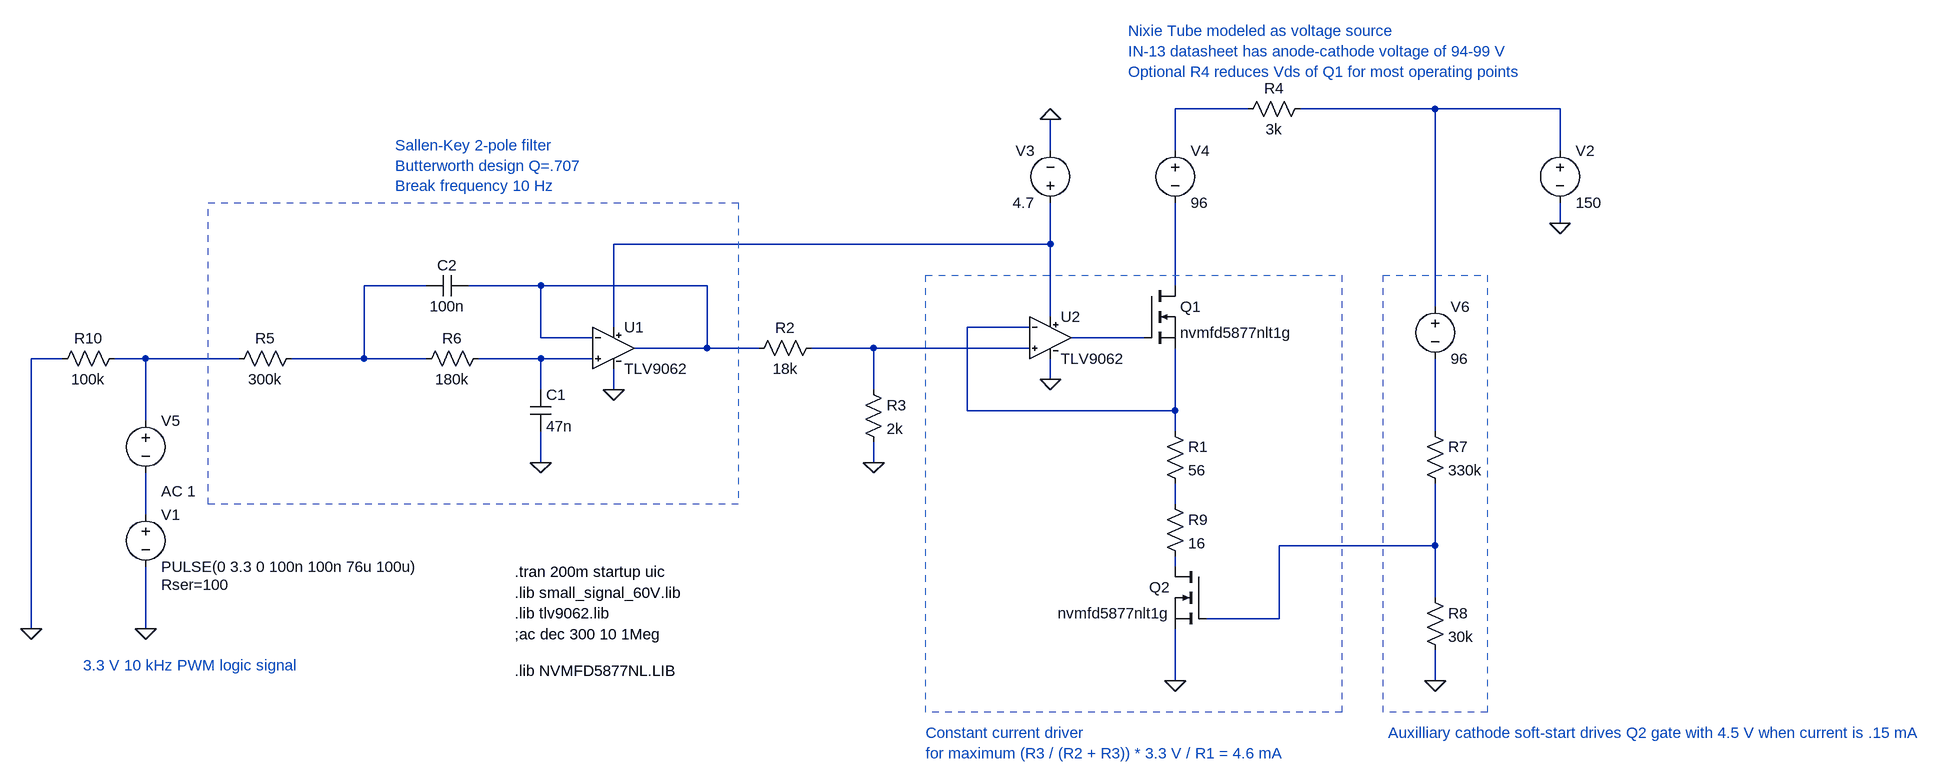
[diagram p0: schematic Nixie driver.asc]
Nixie driver.asc, the LTspice schematic file:
Version 4
SHEET 1 1912 868
WIRE 832 -144 720 -144
WIRE 1120 -144 912 -144
WIRE 1312 -144 1120 -144
WIRE 528 -80 528 -128
WIRE 720 -80 720 -144
WIRE 1312 -80 1312 -144
WIRE 1312 32 1312 0
WIRE 528 64 528 0
WIRE 528 64 -144 64
WIRE -432 128 -528 128
WIRE -256 128 -368 128
WIRE 0 128 -256 128
WIRE 720 128 720 0
WIRE 1120 160 1120 -144
WIRE 528 176 528 64
WIRE -144 192 -144 64
WIRE 496 192 400 192
WIRE -256 208 -256 128
WIRE -176 208 -256 208
WIRE 672 208 560 208
WIRE 0 224 0 128
WIRE 0 224 -112 224
WIRE 80 224 0 224
WIRE 256 224 160 224
WIRE 496 224 256 224
WIRE -992 240 -1040 240
WIRE -864 240 -912 240
WIRE -720 240 -864 240
WIRE -528 240 -528 128
WIRE -528 240 -640 240
WIRE -432 240 -528 240
WIRE -256 240 -352 240
WIRE -176 240 -256 240
WIRE 528 272 528 240
WIRE -256 288 -256 240
WIRE -144 288 -144 256
WIRE 256 288 256 224
WIRE 400 320 400 192
WIRE 720 320 720 224
WIRE 720 320 400 320
WIRE -864 336 -864 240
WIRE 720 352 720 320
WIRE 1120 352 1120 240
WIRE -256 400 -256 352
WIRE 256 400 256 368
WIRE 720 464 720 432
WIRE -864 480 -864 416
WIRE 1120 528 1120 432
WIRE 1120 528 880 528
WIRE 720 560 720 544
WIRE 1120 608 1120 528
WIRE 880 640 880 528
WIRE 880 640 768 640
WIRE -1040 656 -1040 240
WIRE -864 656 -864 560
WIRE 720 736 720 656
WIRE 1120 736 1120 688
FLAG -864 656 0
FLAG 528 272 0
FLAG 528 -128 0
FLAG 1312 32 0
FLAG 720 736 0
FLAG 256 400 0
FLAG -256 400 0
FLAG -144 288 0
FLAG 1120 736 0
FLAG -1040 656 0
SYMBOL voltage -864 464 R0
WINDOW 123 0 0 Left 0
WINDOW 39 24 124 Left 2
SYMATTR SpiceLine Rser=100
SYMATTR InstName V1
SYMATTR Value PULSE(0 3.3 0 100n 100n 76u 100u)
SYMBOL voltage 1312 -96 R0
WINDOW 123 0 0 Left 0
WINDOW 39 0 0 Left 0
SYMATTR InstName V2
SYMATTR Value 150
SYMBOL voltage 528 16 R180
WINDOW 0 24 96 Left 2
WINDOW 3 24 16 Left 2
WINDOW 123 0 0 Left 0
WINDOW 39 0 0 Left 0
SYMATTR InstName V3
SYMATTR Value 4.7
SYMBOL nmos 672 128 R0
SYMATTR InstName Q1
SYMATTR Value nvmfd5877nlt1g
SYMATTR Prefix X
SYMBOL voltage 720 -96 R0
WINDOW 123 0 0 Left 0
WINDOW 39 0 0 Left 0
SYMATTR InstName V4
SYMATTR Value 96
SYMBOL res 704 336 R0
SYMATTR InstName R1
SYMATTR Value 56
SYMBOL res 64 240 R270
WINDOW 0 32 56 VTop 2
WINDOW 3 0 56 VBottom 2
SYMATTR InstName R2
SYMATTR Value 18k
SYMBOL res 240 272 R0
SYMATTR InstName R3
SYMATTR Value 2k
SYMBOL res 928 -160 R90
WINDOW 0 0 56 VBottom 2
WINDOW 3 32 56 VTop 2
SYMATTR InstName R4
SYMATTR Value 3k
SYMBOL res -624 224 R90
WINDOW 0 0 56 VBottom 2
WINDOW 3 32 56 VTop 2
SYMATTR InstName R5
SYMATTR Value 300k
SYMBOL cap -272 288 R0
SYMATTR InstName C1
SYMATTR Value 47n
SYMBOL res -336 224 R90
WINDOW 0 0 56 VBottom 2
WINDOW 3 32 56 VTop 2
SYMATTR InstName R6
SYMATTR Value 180k
SYMBOL cap -368 112 R90
WINDOW 0 0 32 VBottom 2
WINDOW 3 32 32 VTop 2
SYMATTR InstName C2
SYMATTR Value 100n
SYMBOL voltage -864 320 R0
WINDOW 123 24 124 Left 2
WINDOW 39 0 0 Left 0
SYMATTR Value2 AC 1
SYMATTR InstName V5
SYMATTR Value ""
SYMBOL voltage 1120 144 R0
WINDOW 123 0 0 Left 0
WINDOW 39 0 0 Left 0
SYMATTR InstName V6
SYMATTR Value 96
SYMBOL res 1104 336 R0
SYMATTR InstName R7
SYMATTR Value 330k
SYMBOL res 1104 592 R0
SYMATTR InstName R8
SYMATTR Value 30k
SYMBOL nmos 768 560 M0
SYMATTR InstName Q2
SYMATTR Value nvmfd5877nlt1g
SYMATTR Prefix X
SYMBOL TLV9062 -144 160 R0
SYMATTR InstName U1
SYMBOL TLV9062 528 144 R0
SYMATTR InstName U2
SYMBOL res 704 448 R0
SYMATTR InstName R9
SYMATTR Value 16
SYMBOL res -896 224 R90
WINDOW 0 0 56 VBottom 2
WINDOW 3 32 56 VTop 2
SYMATTR InstName R10
SYMATTR Value 100k
TEXT -296 568 Left 2 !.tran 200m startup uic
TEXT -296 600 Left 2 !.lib small_signal_60V.lib
TEXT -296 632 Left 2 !.lib tlv9062.lib
TEXT -296 664 Left 2 !;ac dec 300 10 1Meg
TEXT -480 -88 Left 2 ;Sallen-Key 2-pole filter\nButterworth design Q=.707\nBreak frequency 10 Hz
TEXT 648 -264 Left 2 ;Nixie Tube modeled as voltage source\nIN-13 datasheet has anode-cathode voltage of 94-99 V\nOptional R4 reduces Vds of Q1 for most operating points
TEXT 336 816 Left 2 ;Constant current driver\nfor maximum (R3 / (R2 + R3)) * 3.3 V / R1 = 4.6 mA
TEXT -960 712 Left 2 ;3.3 V 10 kHz PWM logic signal
TEXT 1048 816 Left 2 ;Auxilliary cathode soft-start drives Q2 gate with 4.5 V when current is .15 mA
TEXT -296 720 Left 2 !.lib NVMFD5877NL.LIB
RECTANGLE Normal 48 464 -768 0 1
RECTANGLE Normal 976 784 336 112 1
RECTANGLE Normal 1200 784 1040 112 1

The netlist it stands for:
* Nixie driver.asc
V1 N014 0 PULSE(0 3.3 0 100n 100n 76u 100u) Rser=100
V2 N002 0 150
V3 N003 0 4.7
XQ1 N006 N008 N007 nvmfd5877nlt1g  ; pins D G S
V4 N001 N006 96
R1 N007 N013 56
R2 N005 N009 18k
R3 N009 0 2k
R4 N002 N001 3k
R5 N004 N010 300k
C1 N011 0 47n
R6 N011 N004 180k
C2 N005 N004 100n
V5 N010 N014 AC 1
V6 N002 N012 96
R7 N012 N015 330k
R8 N015 0 30k
XQ2 N016 N015 0 nvmfd5877nlt1g  ; pins D G S
XU1 N011 N005 N003 0 N005 TLV9062  ; pins In+ In- V+ V- OUT
XU2 N009 N007 N003 0 N008 TLV9062  ; pins In+ In- V+ V- OUT
R9 N013 N016 16
R10 N010 0 100k
.tran 200m startup uic
.lib small_signal_60V.lib
.lib tlv9062.lib
;ac dec 300 10 1Meg
* Sallen-Key 2-pole filter
* Butterworth design Q=.707
* Break frequency 10 Hz
* Nixie Tube modeled as voltage source
* IN-13 datasheet has anode-cathode voltage of 94-99 V
* Optional R4 reduces Vds of Q1 for most operating points
* Constant current driver
* for maximum (R3 / (R2 + R3)) * 3.3 V / R1 = 4.6 mA
* 3.3 V 10 kHz PWM logic signal
* Auxilliary cathode soft-start drives Q2 gate with 4.5 V when current is .15 mA
.lib NVMFD5877NL.LIB
.backanno
.end